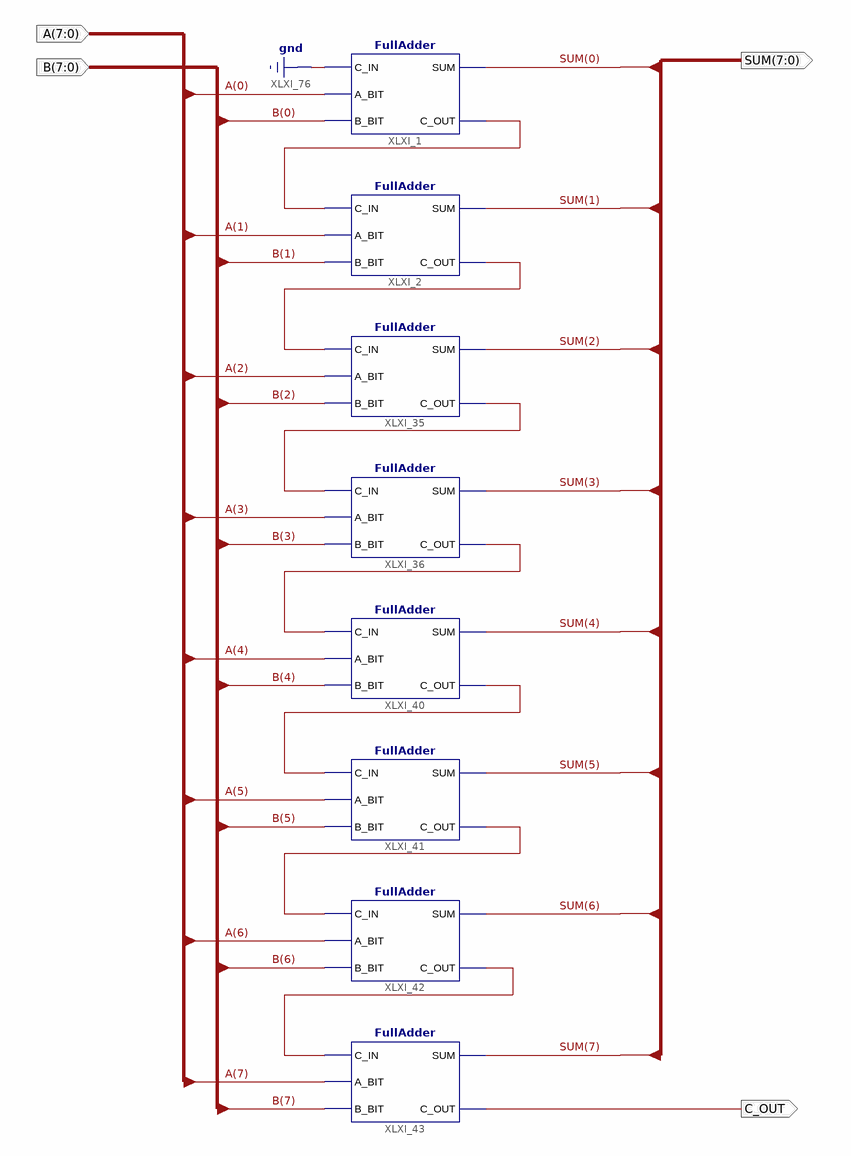
[diagram p0: schematic sheet 1]
// Xilinx ISE schematic Adder8Bits_Bus.sch (spartan6) as structural Verilog: 8 symbols, 4 ports
module Adder8Bits_Bus (
  input  [7:0] A,
  input  [7:0] B,
  output [7:0] SUM,
  output C_OUT
);

  wire XLXN_2, XLXN_4, XLXN_6, XLXN_8, XLXN_10, XLXN_12, XLXN_14;

  FullAdder XLXI_1 (.C_IN(1'b0), .A_BIT(A[0]), .B_BIT(B[0]), .SUM(SUM[0]), .C_OUT(XLXN_2));
  FullAdder XLXI_2 (.C_IN(XLXN_2), .A_BIT(A[1]), .B_BIT(B[1]), .SUM(SUM[1]), .C_OUT(XLXN_4));
  FullAdder XLXI_35 (.C_IN(XLXN_4), .A_BIT(A[2]), .B_BIT(B[2]), .SUM(SUM[2]), .C_OUT(XLXN_6));
  FullAdder XLXI_36 (.C_IN(XLXN_6), .A_BIT(A[3]), .B_BIT(B[3]), .SUM(SUM[3]), .C_OUT(XLXN_8));
  FullAdder XLXI_40 (.C_IN(XLXN_8), .A_BIT(A[4]), .B_BIT(B[4]), .SUM(SUM[4]), .C_OUT(XLXN_10));
  FullAdder XLXI_41 (.C_IN(XLXN_10), .A_BIT(A[5]), .B_BIT(B[5]), .SUM(SUM[5]), .C_OUT(XLXN_12));
  FullAdder XLXI_42 (.C_IN(XLXN_12), .A_BIT(A[6]), .B_BIT(B[6]), .SUM(SUM[6]), .C_OUT(XLXN_14));
  FullAdder XLXI_43 (.C_IN(XLXN_14), .A_BIT(A[7]), .B_BIT(B[7]), .SUM(SUM[7]), .C_OUT(C_OUT));
endmodule
